# Altium schematic sheet FLS.SchDoc
size A0
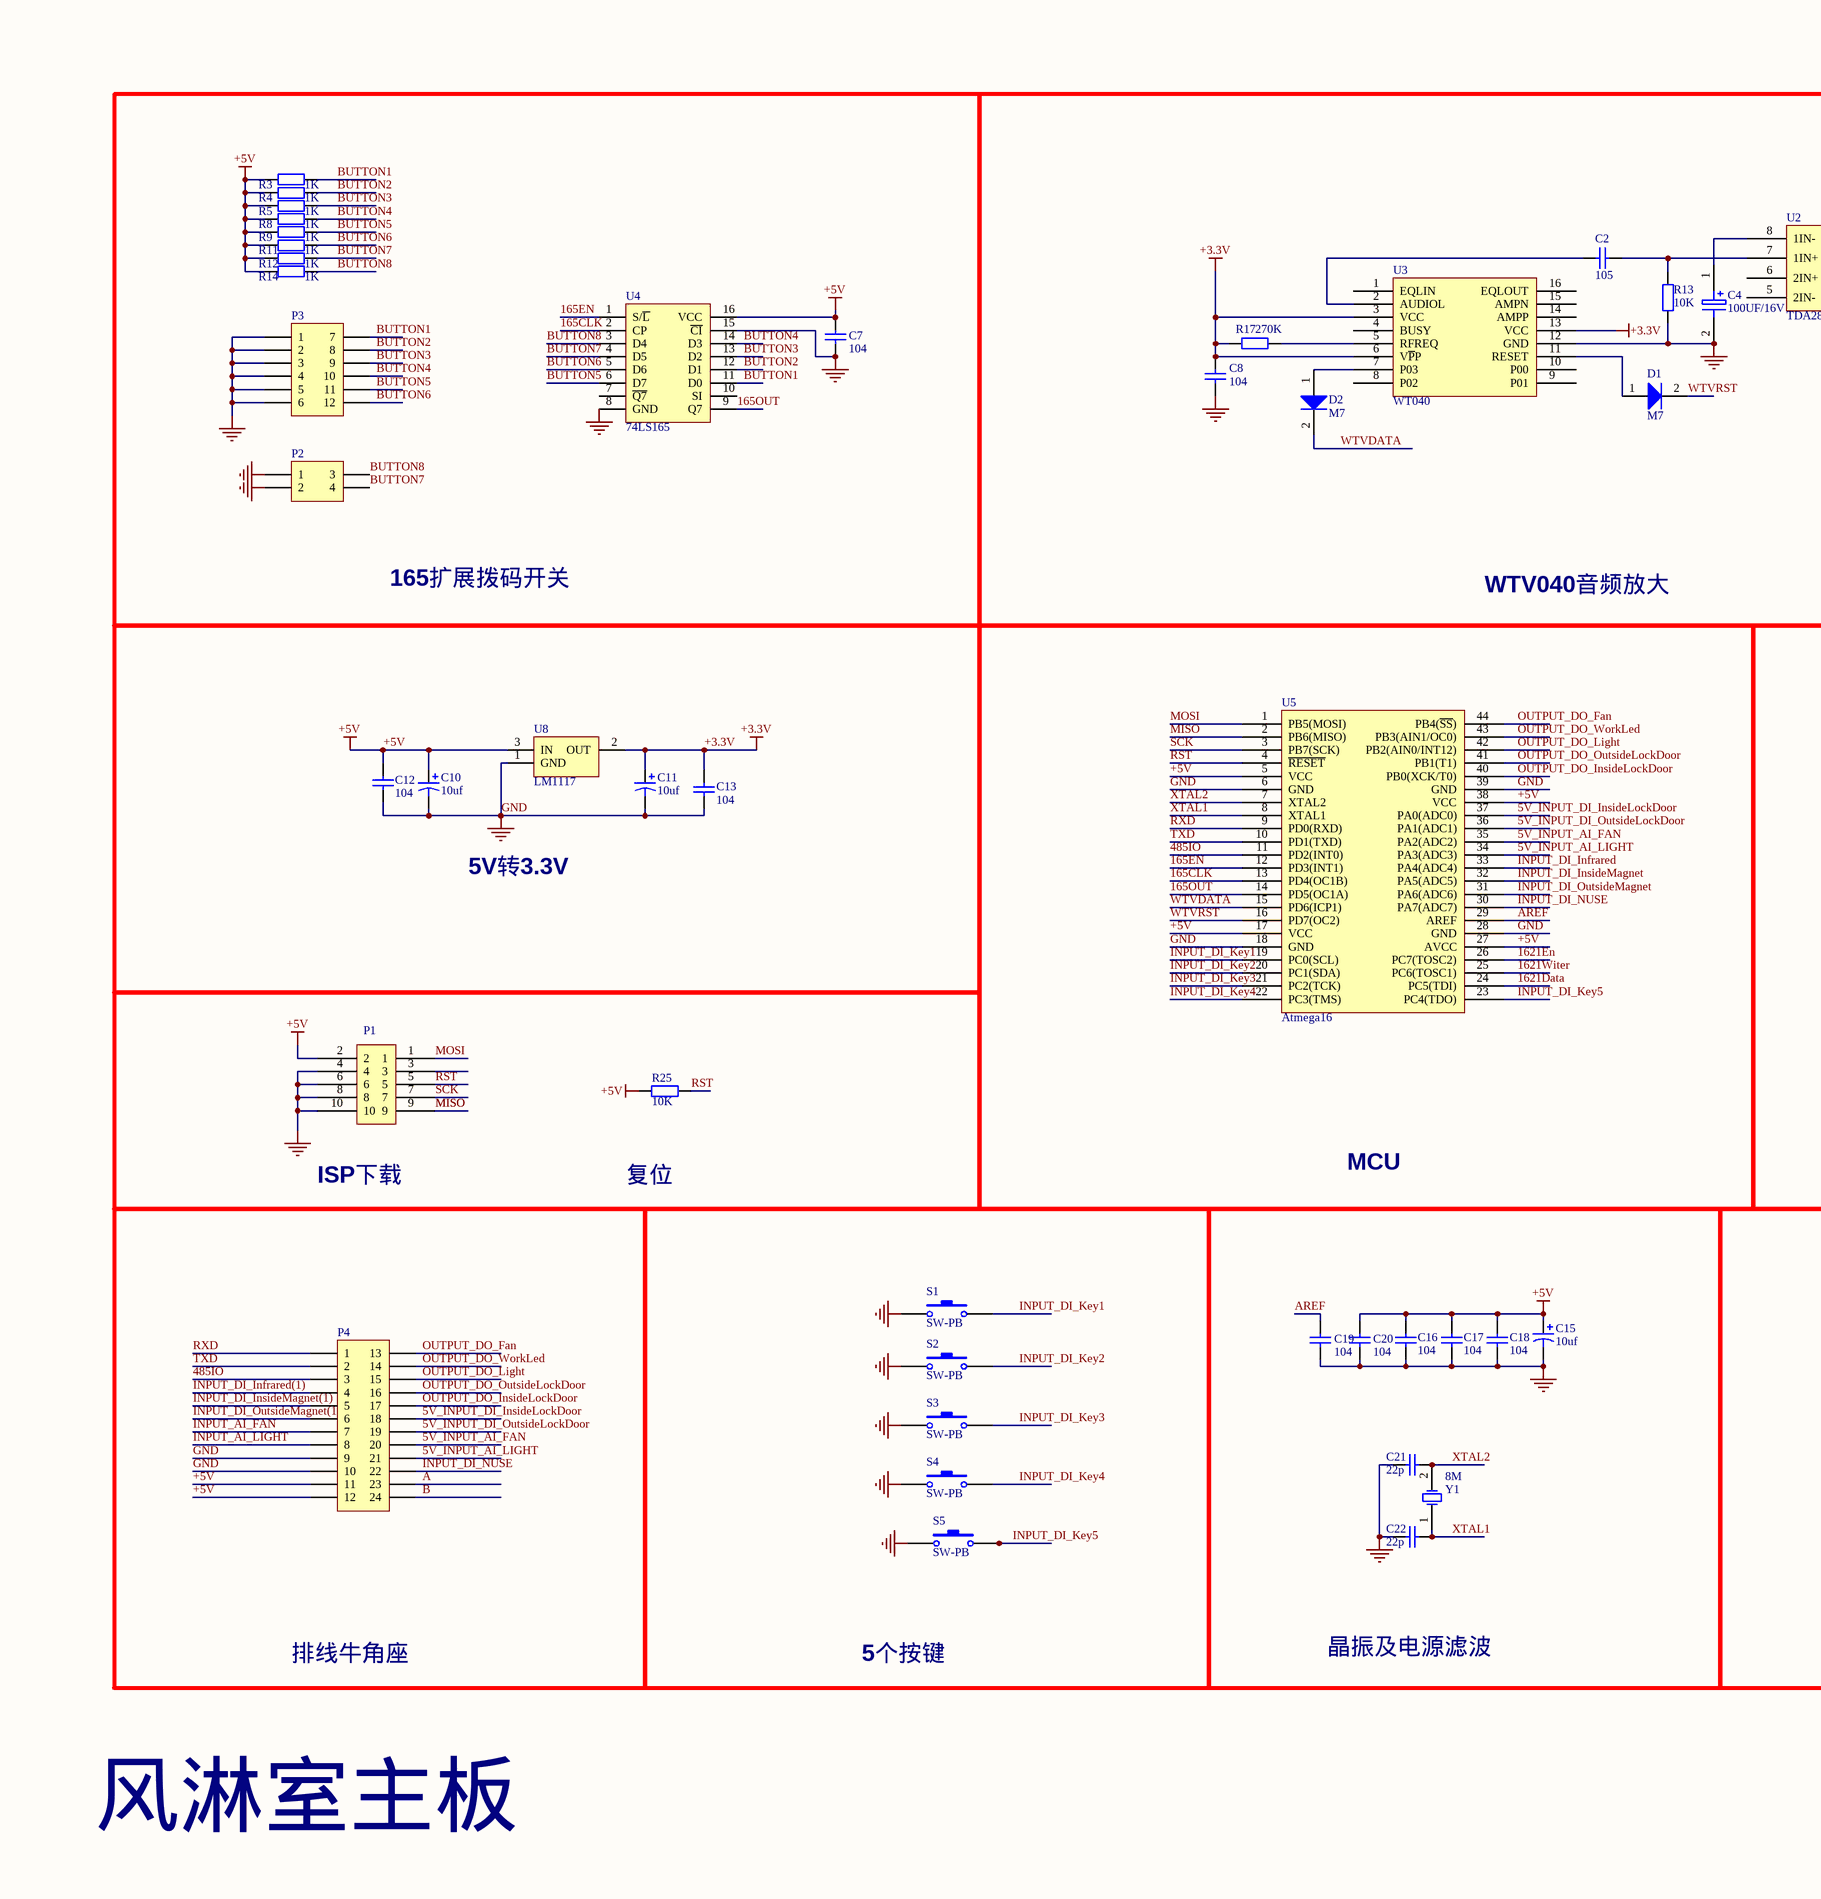
[diagram p0: FLS.SchDoc, top left]
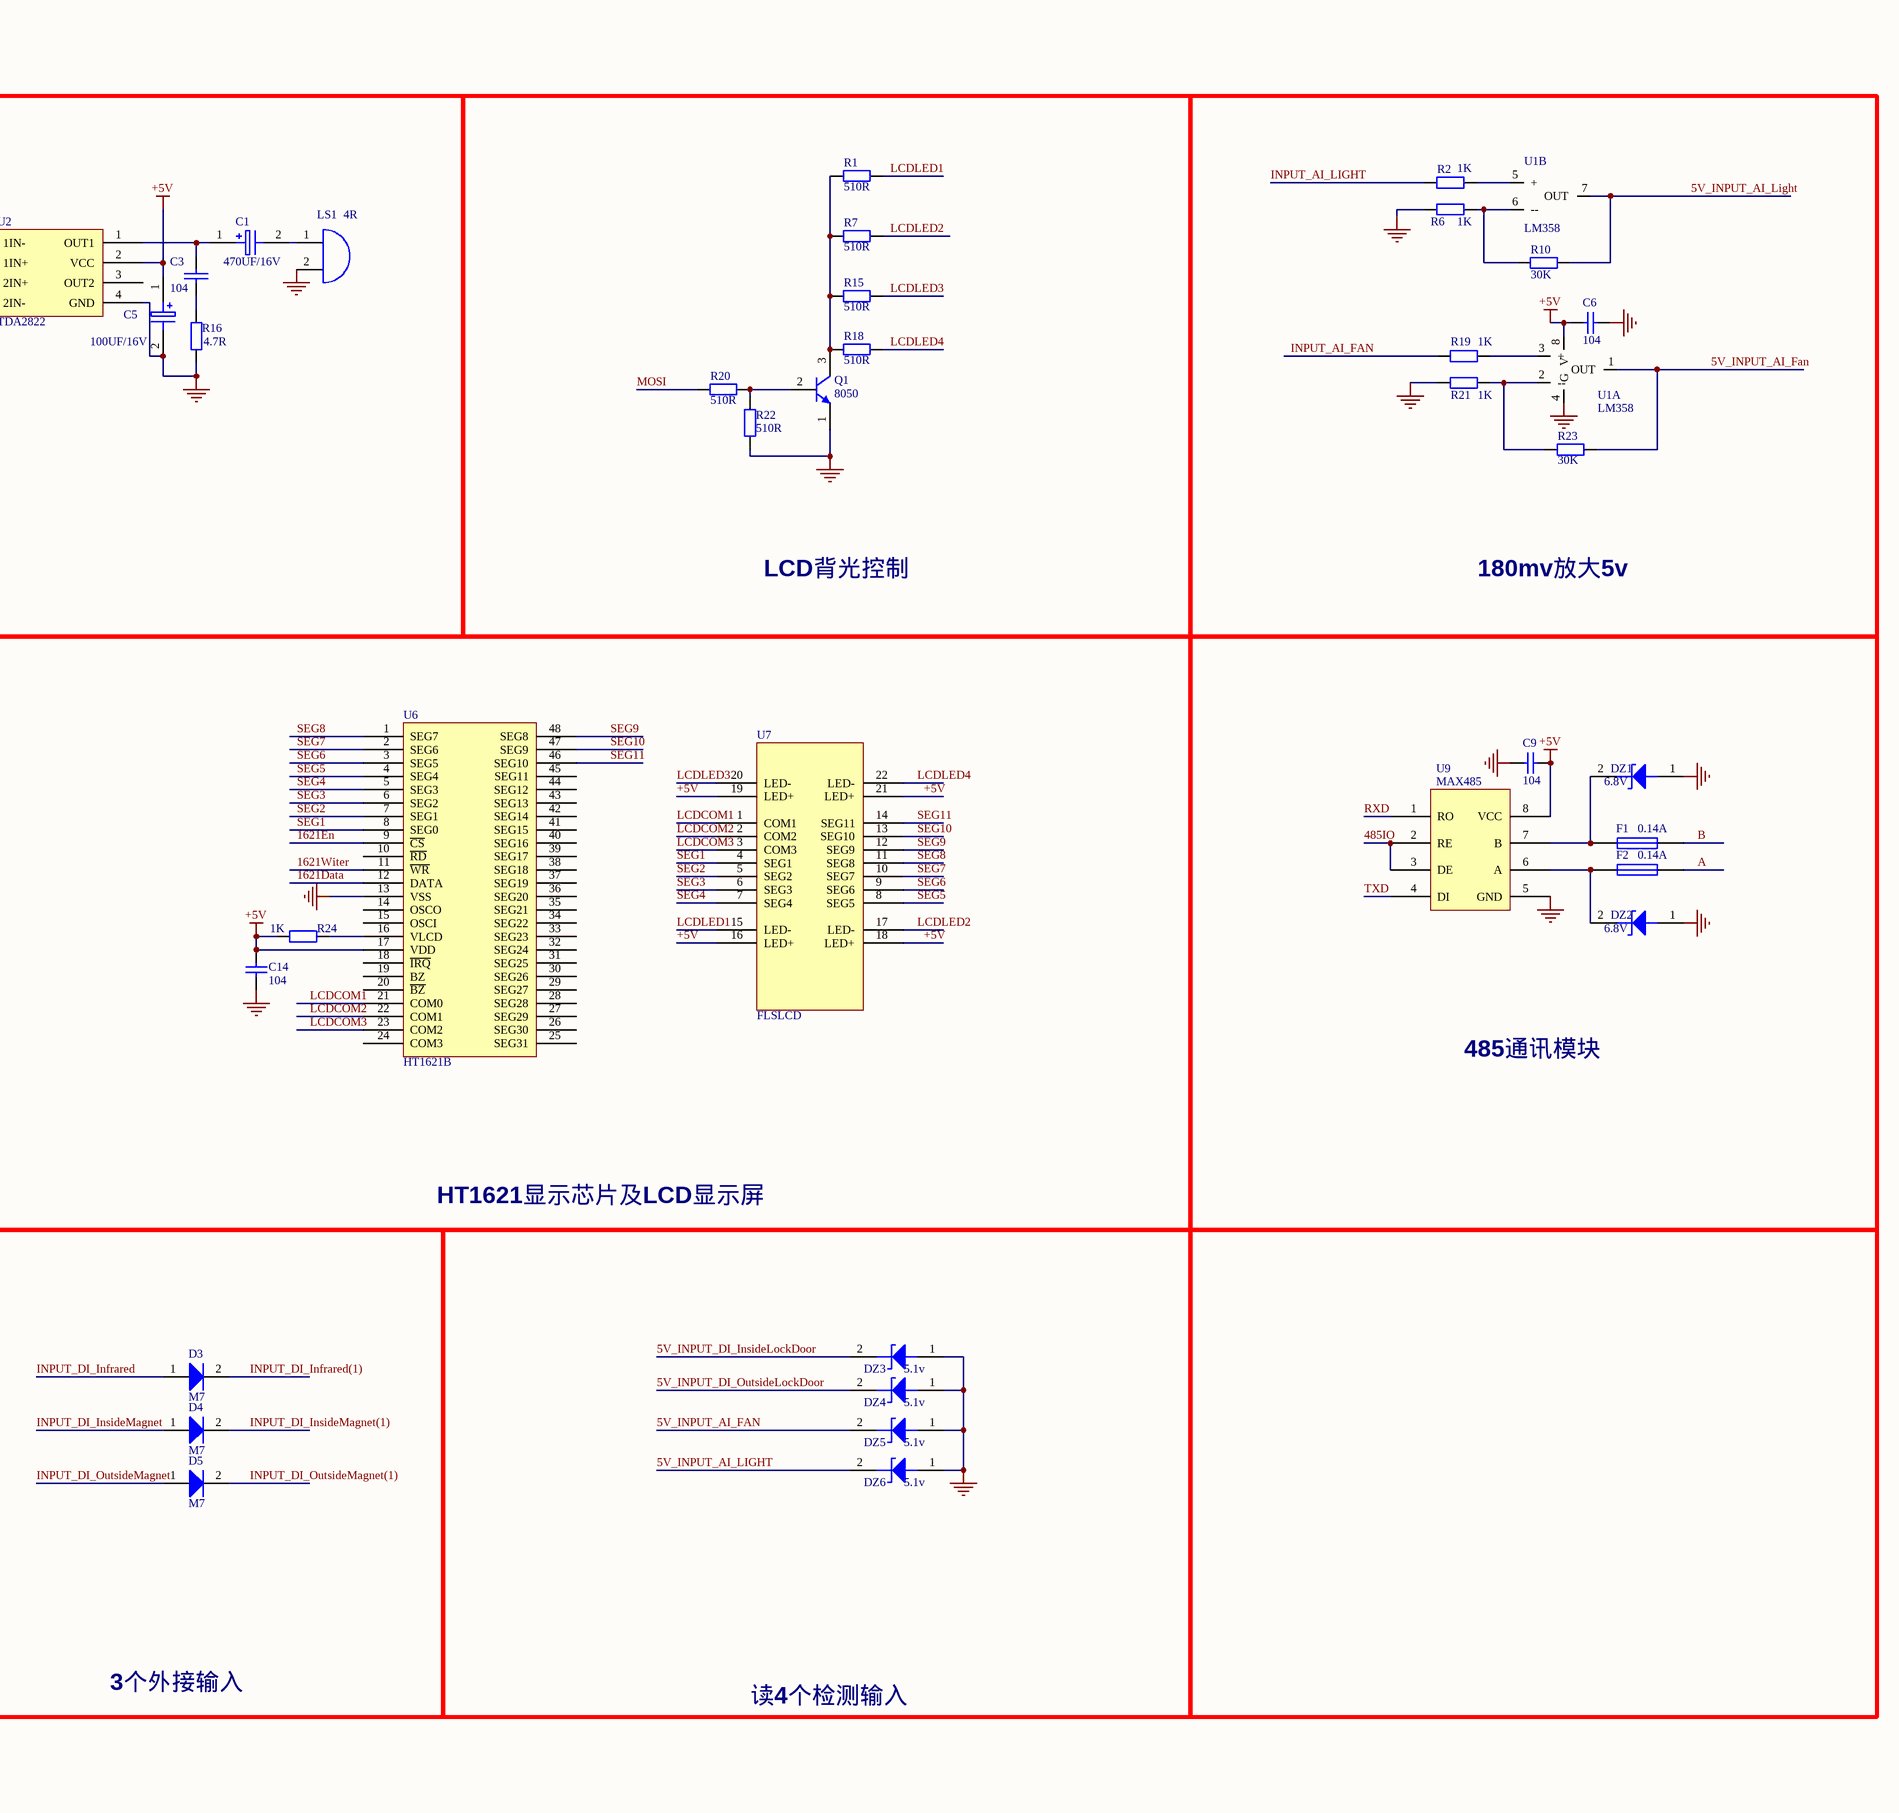
[diagram p1: FLS.SchDoc, top middle]
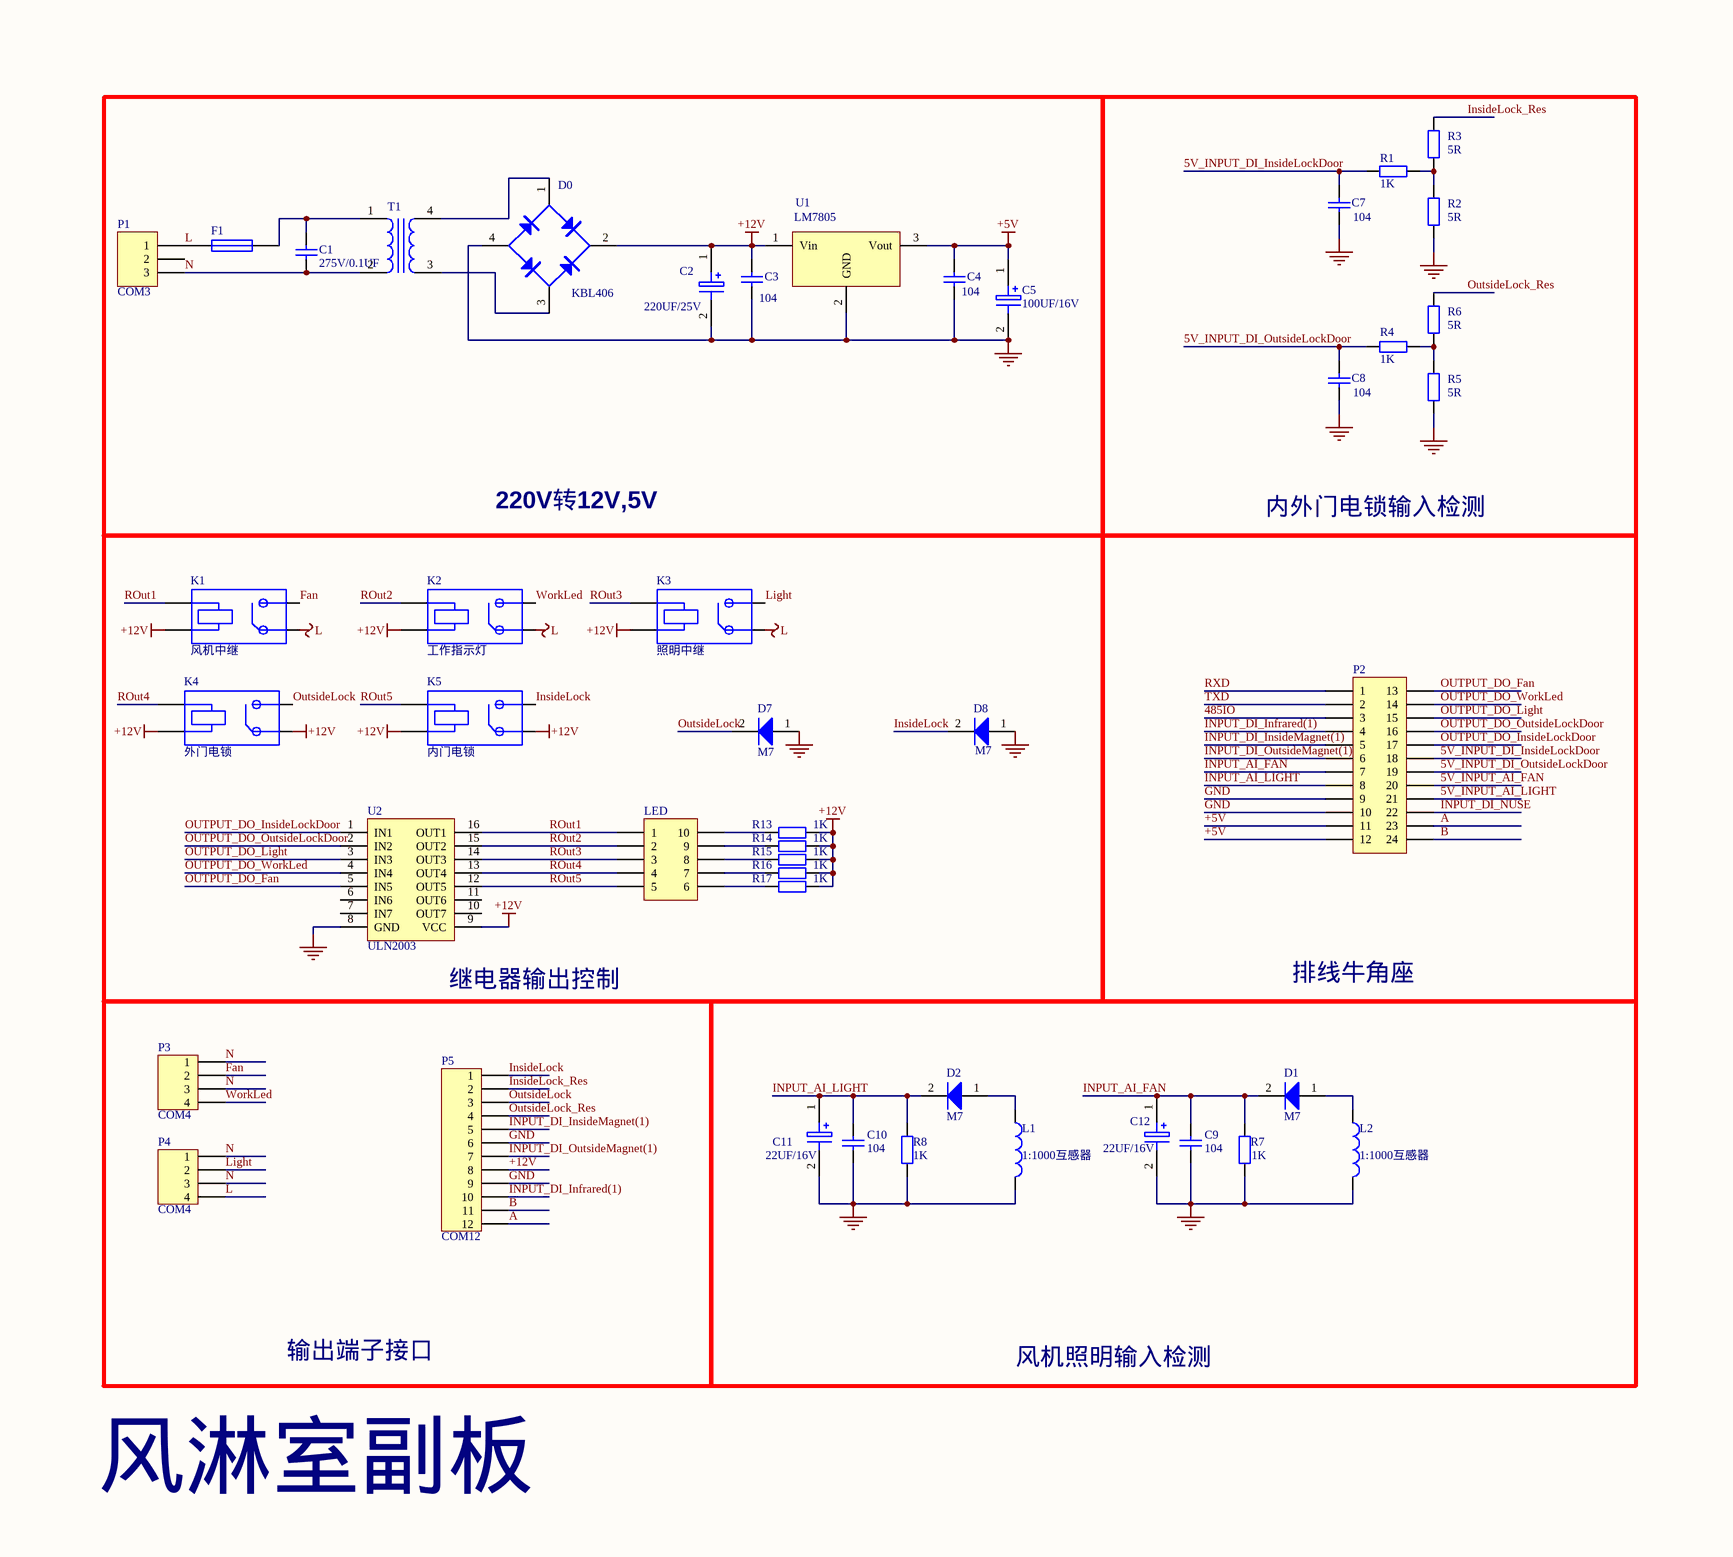
[diagram p2: FLS.SchDoc, bottom left]

## Parts
(Parts that share a designator on the sheet are numbered #1, #2 ... from top to bottom, then left to right.)
C1#1  470UF/16V  [E6.5MM]
C1#2  275V/0.1UF  [cap13.5mm]
C2#1  105  [0805C]
C2#2  220UF/25V  [E10mm]
C3#1  104  [0805C]
C3#2  104  [C100]
C4#1  100UF/16V  [E6.5MM]
C4#2  104  [C100]
C5#1  100UF/16V  [E6.5MM]
C5#2  100UF/16V  [E10mm]
C6  104  [0805C]
C7#1  104  [0805C]
C7#2  104  [C100]
C8#1  104  [0805C]
C8#2  104  [C100]
C9#1  104  [0805C]
C9#2  104  [C100]
C10#1  10uf  [E6.5MM]
C10#2  104  [C100]
C11#1  10uf  [E6.5MM]
C11#2  22UF/16V  [E5mm]
C12#1  104  [0805C]
C12#2  22UF/16V  [E5mm]
C13  104  [0805C]
C14  104  [0805C]
C15  10uf  [E6.5MM]
C16  104  [0805C]
C17  104  [0805C]
C18  104  [0805C]
C19  104  [0805C]
C20  104  [0805C]
C21  22p  [0805C]
C22  22p  [0805C]
D0  KBL406  [BL406]
D1#1  M7  [M7]
D1#2  M7  [DIODE2]
D2#1  M7  [M7]
D2#2  M7  [DIODE2]
D3  M7  [m7]
D4  M7  [M7]
D5  M7  [M7]
D7  M7  [DIODE2]
D8  M7  [DIODE2]
DZ1  6.8V  [SMBJ]
DZ2  6.8V  [SMBJ]
DZ3  5.1v  [3.3稳压管]
DZ4  5.1v  [3.3稳压管]
DZ5  5.1v  [3.3稳压管]
DZ6  5.1v  [3.3稳压管]
F1#1  0.14A  [保险丝140MA]
F1#2  (no value)  [RAD0.878]
F2  0.14A  [保险丝140MA]
K1  风机中继  [RELAY12V]
K2  工作指示灯  [RELAY12V]
K3  照明中继  [RELAY12V]
K4  外门电锁  [RELAY12V]
K5  内门电锁  [RELAY12V]
L1  1:1000互感器  [DL13.5MM]
L2  1:1000互感器  [DL13.5MM]
LED  (no value)  [DIP20]
LS1  4R  [2]
P1#1  CON10  [ISP]  (value not drawn)
P1#2  COM3  [PL3]
P2#1  (no value)  [4P]
P2#2  Header 12X2A  [20P]  (value not drawn)
P3#1  Header 6X2A  [12P]  (value not drawn)
P3#2  COM4  [PL4]
P4#1  Header 12X2A  [20P]  (value not drawn)
P4#2  COM4  [PL4]
P5  COM12  [PL12]
Q1  8050  [SO-G3/C2.5]
R1#1  510R  [0805R]
R1#2  1K  [AXIAL0.4]
R2#1  1K  [0805R]
R2#2  5R  [AXIAL-0.6]
R3#1  1K  [0805R]
R3#2  5R  [AXIAL-0.6]
R4#1  1K  [0805R]
R4#2  1K  [AXIAL0.4]
R5#1  1K  [0805R]
R5#2  5R  [AXIAL-0.6]
R6#1  1K  [0805R]
R6#2  5R  [AXIAL-0.6]
R7#1  510R  [0805R]
R7#2  1K  [AXIAL0.4]
R8#1  1K  [0805R]
R8#2  1K  [AXIAL0.4]
R9  1K  [0805R]
R10  30K  [0805R]
R11  1K  [0805R]
R12  1K  [0805R]
R13#1  10K  [0805R]
R13#2  1K  [AXIAL0.4]
R14#1  1K  [0805R]
R14#2  1K  [AXIAL0.4]
R15#1  510R  [0805R]
R15#2  1K  [AXIAL0.4]
R16#1  4.7R  [0805R]
R16#2  1K  [AXIAL0.4]
R17#1  270K  [0805R]
R17#2  1K  [AXIAL0.4]
R18  510R  [0805R]
R19  1K  [0805R]
R20  510R  [0805R]
R21  1K  [0805R]
R22  510R  [0805R]
R23  30K  [0805R]
R24  1K  [0805R]
R25  10K  [0805R]
S1  SW-PB  [KEYL]
S2  SW-PB  [KEYL]
S3  SW-PB  [KEYL]
S4  SW-PB  [KEYL]
S5  SW-PB  [KEYL]
T1  bianyaqi  [TTT]  (value not drawn)
U1#1  LM358  [SOP8]  (parts A,B of 2)
U1#2  LM7805  [TO220L]
U2#1  TDA2822  [SOP8]
U2#2  ULN2003  [DIP16]
U3  WT040  [SOP-16]
U4  74LS165  [SOP-16]
U5  Atmega16  [44A]
U6  HT1621B  [SOP48 - DUPLICATE]
U7  FLSLCD  [LCD]
U8  LM1117  [SOT-223]
U9  MAX485  [SOP8]
Y1  8M  [XTP2]

## Blocks framed on the sheet
165扩展拨码开关: C7#1 P2#1 P3#1 R3#1 R4#1 R5#1 R8#1 R9 R11 R12 R14#1 U4
WTV040音频放大: C1#1 C2#1 C3#1 C4#1 C5#1 C8#1 D1#1 D2#1 LS1 R13#1 R16#1 R17#1 U2#1 U3
LCD背光控制: Q1 R1#1 R7#1 R15#1 R18 R20 R22
180mv放大5v: C6 R2#1 R6#1 R10 R19 R21 R23 U1#1
5V转3.3V: C10#1 C11#1 C12#1 C13 U8
MCU: U5
HT1621显示芯片及LCD显示屏: C14 R24 U6 U7
485通讯模块: C9#1 DZ1 DZ2 F1#1 F2 U9
排线牛角座: P4#1
5个按键: S1-S5
晶振及电源滤波: C15-C22 Y1
3个外接输入: D3-D5
读4个检测输入: DZ3-DZ6
220V转12V,5V: C1#2 C2#2 C3#2 C4#2 C5#2 D0 F1#2 P1#2 T1 U1#2
内外门电锁输入检测: C7#2 C8#2 R1#2 R2#2 R3#2 R4#2 R5#2 R6#2
继电器输出控制: D7 D8 K1-K5 LED R13#2 R14#2 R15#2 R16#2 R17#2 U2#2
排线牛角座: P2#2
风机照明输入检测: C9#2 C10#2 C11#2 C12#2 D1#2 D2#2 L1 L2 R7#2 R8#2

## Nets
+3.3V: C8#1.2 C11#1.1 C13.2 R17#1.2 U3.3(VCC) U3.6(V~{P}P) U3.13(VCC) U8.2(OUT)
+5V: C4#2.2 C5#1.1 C5#2.1 C6.1 C7#1.2 C9#1.1 C10#1.1 C12#1.2 C14.2 C15.1 C16.2 C17.2 C18.1 C20.2 P1#1.2 P2#2.11 P2#2.12 P4#1.11 P4#1.12 R3#1.1 R4#1.1 R5#1.1 R8#1.1 R9.1 R11.1 R12.1 R14#1.1 R24.2 R25.2 U1#1.8(V) U1#2.3(Vout) U2#1.2(VCC) U4.16(VCC) U5.5(VCC) U5.17(VCC) U5.27(AVCC) U5.38(VCC) U6.17(VDD) U7.16(LED+) U7.18(LED+) U7.19(LED+) U7.21(LED+) U8.3(IN) U9.8(VCC)
+12V: C2#2.1 C3#2.2 D0.2(V+) K1.2 K2.2 K3.2 K4.2 K4.4 K5.2 K5.4 P5.8 R13#2.1 R14#2.1 R15#2.1 R16#2.1 R17#2.1 U1#2.1(Vin) U2#2.9(VCC)
GND: C2#2.2 C3#2.1 C4#1.2 C4#2.1 C5#1.2 C5#2.2 C6.2 C7#1.1 C7#2.1 C8#1.1 C8#2.1 C9#1.2 C9#2.2 C10#1.2 C10#2.2 C11#1.2 C11#2.2 C12#1.1 C12#2.2 C13.1 C14.1 C15.2 C16.1 C17.1 C18.2 C19.1 C20.1 C21.2 C22.2 D0.4(V-) D7.1(A) D8.1(A) DZ1.1(A) DZ2.1(A) DZ3.1(A) DZ4.1(A) DZ5.1(A) DZ6.1(A) L1.1 L2.1 LS1.2(B) P1#1.4 P1#1.6 P1#1.8 P1#1.10 P2#1.1 P2#1.2 P2#2.9 P2#2.10 P3#1.1 P3#1.2 P3#1.3 P3#1.4 P3#1.5 P3#1.6 P4#1.9 P4#1.10 P5.6 P5.9 Q1.1(E) R2#2.2 R5#2.1 R6#1.2 R7#2.2 R8#2.1 R13#1.2 R16#1.1 R21.1 R22.1 S1.1 S2.1 S3.1 S4.1 S5.1 U1#1.4(G) U1#2.2(GND) U2#1.4(GND) U2#2.8(GND) U3.12(GND) U4.8(GND) U4.15(~{CI}) U5.6(GND) U5.18(GND) U5.28(GND) U5.39(GND) U6.13(VSS) U8.1(GND) U9.5(GND)
L: F1#2.2 K1.4 K2.4 K3.4 P1#2.1 P4#2.4
5V_INPUT_AI_FAN: DZ5.2(K) P2#2.20 P4#1.20 R23.2 U1#1.1(OUT) U5.35(PA2(ADC2))
5V_INPUT_AI_LIGHT: DZ6.2(K) P2#2.21 P4#1.21 R10.1 U1#1.7(OUT) U5.34(PA3(ADC3))
5V_INPUT_DI_InsideLockDoor: C7#2.2 DZ3.2(K) P2#2.18 P4#1.18 R1#2.2 U5.37(PA0(ADC0))
5V_INPUT_DI_OutsideLockDoor: C8#2.2 DZ4.2(K) P2#2.19 P4#1.19 R4#2.1 U5.36(PA1(ADC1))
165CLK: U4.2(CP) U5.13(PD4(OC1B))
165EN: U4.1(S/~{L}) U5.12(PD3(INT1))
165OUT: U4.9(Q7) U5.14(PD5(OC1A))
485IO: P2#2.3 P4#1.3 U5.11(PD2(INT0)) U9.2(RE) U9.3(DE)
1621Data: U5.24(PC5(TDI)) U6.12(DATA)
1621En: U5.26(PC7(TOSC2)) U6.9(~{CS})
1621Witer: U5.25(PC6(TOSC1)) U6.11(~{WR})
A: F2.1 P2#2.23 P4#1.23 P5.12
AREF: C19.2 U5.29(AREF)
B: F1#1.2 P2#2.24 P4#1.24 P5.11
BUTTON1: P3#1.7 R3#1.2 U4.11(D0)
BUTTON2: P3#1.8 R4#1.2 U4.12(D1)
BUTTON3: P3#1.9 R5#1.2 U4.13(D2)
BUTTON4: P3#1.10 R8#1.2 U4.14(D3)
BUTTON5: P3#1.11 R9.2 U4.6(D7)
BUTTON6: P3#1.12 R11.2 U4.5(D6)
BUTTON7: P2#1.4 R12.2 U4.4(D5)
BUTTON8: P2#1.3 R14#1.2 U4.3(D4)
Fan: K1.3 P3#2.2
INPUT_AI_FAN: C9#2.1 C12#2.1 D1#2.2(K) P2#2.7 P4#1.7 R7#2.1 R19.2
INPUT_AI_LIGHT: C10#2.1 C11#2.1 D2#2.2(K) P2#2.8 P4#1.8 R2#1.2 R8#2.2
INPUT_DI_Infrared: D3.1(A) U5.33(PA4(ADC4))
INPUT_DI_Infrared(1): D3.2(K) P2#2.4 P4#1.4 P5.10
INPUT_DI_InsideMagnet: D4.1(A) U5.32(PA5(ADC5))
INPUT_DI_InsideMagnet(1): D4.2(K) P2#2.5 P4#1.5 P5.5
INPUT_DI_Key1: S1.2 U5.19(PC0(SCL))
INPUT_DI_Key2: S2.2 U5.20(PC1(SDA))
INPUT_DI_Key3: S3.2 U5.21(PC2(TCK))
INPUT_DI_Key4: S4.2 U5.22(PC3(TMS))
INPUT_DI_Key5: S5.2 U5.23(PC4(TDO))
INPUT_DI_NUSE: P2#2.22 P4#1.22 U5.30(PA7(ADC7))
INPUT_DI_OutsideMagnet: D5.1(A) U5.31(PA6(ADC6))
INPUT_DI_OutsideMagnet(1): D5.2(K) P2#2.6 P4#1.6 P5.7
InsideLock: D8.2(K) K5.3 P5.1
InsideLock_Res: P5.2 R3#2.1
LCDCOM1: U6.21(COM0) U7.1(COM1)
LCDCOM2: U6.22(COM1) U7.2(COM2)
LCDCOM3: U6.23(COM2) U7.3(COM3)
LCDLED1: R1#1.1 U7.15(LED-)
LCDLED2: R7#1.1 U7.17(LED-)
LCDLED3: R15#1.1 U7.20(LED-)
LCDLED4: R18.1 U7.22(LED-)
Light: K3.3 P4#2.2
MISO: P1#1.9 U5.2(PB6(MISO))
MOSI: P1#1.1 R20.1 U5.1(PB5(MOSI))
N: C1#2.1 P1#2.3 P3#2.1 P3#2.3 P4#2.1 P4#2.3 T1.2
OUTPUT_DO_Fan: P2#2.13 P4#1.13 U2#2.5(IN5) U5.44(PB4(~{SS}))
OUTPUT_DO_InsideLockDoor: P2#2.17 P4#1.17 U2#2.1(IN1) U5.40(PB0(XCK/T0))
OUTPUT_DO_Light: P2#2.15 P4#1.15 U2#2.3(IN3) U5.42(PB2(AIN0/INT12))
OUTPUT_DO_OutsideLockDoor: P2#2.16 P4#1.16 U2#2.2(IN2) U5.41(PB1(T1))
OUTPUT_DO_WorkLed: P2#2.14 P4#1.14 U2#2.4(IN4) U5.43(PB3(AIN1/OC0))
OutsideLock: D7.2(K) K4.3 P5.3
OutsideLock_Res: P5.4 R6#2.2
ROut1: K1.1 LED.1 U2#2.16(OUT1)
ROut2: K2.1 LED.2 U2#2.15(OUT2)
ROut3: K3.1 LED.3 U2#2.14(OUT3)
ROut4: K4.1 LED.4 U2#2.13(OUT4)
ROut5: K5.1 LED.5 U2#2.12(OUT5)
RST: P1#1.5 R25.1 U5.4(~{RESET})
RXD: P2#2.1 P4#1.1 U5.9(PD0(RXD)) U9.1(RO)
SCK: P1#1.7 U5.3(PB7(SCK))
SEG1: U6.8(SEG0) U7.4(SEG1)
SEG2: U6.7(SEG1) U7.5(SEG2)
SEG3: U6.6(SEG2) U7.6(SEG3)
SEG4: U6.5(SEG3) U7.7(SEG4)
SEG5: U6.4(SEG4) U7.8(SEG5)
SEG6: U6.3(SEG5) U7.9(SEG6)
SEG7: U6.2(SEG6) U7.10(SEG7)
SEG8: U6.1(SEG7) U7.11(SEG8)
SEG9: U6.48(SEG8) U7.12(SEG9)
SEG10: U6.47(SEG9) U7.13(SEG10)
SEG11: U6.46(SEG10) U7.14(SEG11)
TXD: P2#2.2 P4#1.2 U5.10(PD1(TXD)) U9.4(DI)
WorkLed: K2.3 P3#2.4
WTVDATA: D2#1.2(K) U5.15(PD6(ICP1))
WTVRST: D1#1.2(K) U5.16(PD7(OC2))
XTAL1: C22.1 U5.8(XTAL1) Y1.1(OSC1)
XTAL2: C21.1 U5.7(XTAL2) Y1.2(OSC2)
NetC1#1_1: C1#1.1 C3#1.2 U2#1.1(OUT1)
NetC1#1_2: C1#1.2 LS1.1(A)
NetC1#2_2: C1#2.2 F1#2.1 T1.1
NetC2#1_1: C2#1.1 R13#1.1 U2#1.7(1IN+)
NetC2#1_2: C2#1.2 U3.2(AUDIOL)
NetC3#1_1: C3#1.1 R16#1.2
NetC4#1_1: C4#1.1 U2#1.8(1IN-)
NetD0_1: D0.1(AC) T1.4
NetD0_3: D0.3(AC) T1.3
NetD1#1_1: D1#1.1(A) U3.11(RESET)
NetD1#2_1: D1#2.1(A) L2.2
NetD2#1_1: D2#1.1(A) U3.7(P03)
NetD2#2_1: D2#2.1(A) L1.2
NetDZ1_2: DZ1.2(K) F1#1.1 U9.7(B)
NetDZ2_2: DZ2.2(K) F2.2 U9.6(A)
NetLED_6: LED.6 R17#2.2
NetLED_7: LED.7 R16#2.2
NetLED_8: LED.8 R15#2.2
NetLED_9: LED.9 R14#2.2
NetLED_10: LED.10 R13#2.2
NetQ1_2: Q1.2(B) R20.2 R22.2
NetQ1_3: Q1.3(C) R1#1.2 R7#1.2 R15#1.2 R18.2
NetR1#2_1: R1#2.1 R2#2.1 R3#2.2
NetR2#1_1: R2#1.1 U1#1.5(+)
NetR4#2_2: R4#2.2 R5#2.2 R6#2.1
NetR6#1_1: R6#1.1 R10.2 U1#1.6(--)
NetR17#1_1: R17#1.1 U3.5(RFREQ)
NetR19_1: R19.1 U1#1.3(+)
NetR21_2: R21.2 R23.1 U1#1.2(--)
NetR24_1: R24.1 U6.16(VLCD)

Not connected (* = marked no-connect by the designer): P1#1 3; P1#2 2; U2#1 3(OUT2) 5(2IN-) 6(2IN+); U2#2 6(IN6) 7(IN7) 10(OUT7) 11(OUT6); U3 1(EQLIN) 4(BUSY) 8(P02) 9(P01) 10(P00) 14(AMPP) 15(AMPN) 16(EQLOUT); U4 7(~{Q7}) 10(SI); U6 10(~{RD}) 14(OSCO) 15(OSCI) 18(~{IRQ}) 19(BZ) 20(~{BZ}) 24(COM3) 25(SEG31) 26(SEG30) 27(SEG29) 28(SEG28) 29(SEG27) 30(SEG26) 31(SEG25) 32(SEG24) 33(SEG23) 34(SEG22) 35(SEG21) 36(SEG20) 37(SEG19) 38(SEG18) 39(SEG17) 40(SEG16) 41(SEG15) 42(SEG14) 43(SEG13) 44(SEG12) 45(SEG11)

## Notes on the sheet
- ISP下载
- 复位
- 风淋室主板
- 输出端子接口
- 风淋室副板

## Library data of the parts
C1#1 C2#2 C4#1 C5#1 C5#2 C11#2 C12#2 = ELECTRO1: Electrolytic Capacitor; Comment_1: 1000UF/25V; Comment_2: 1000UF/25V
C1#2 C2#1 C3#2 C4#2 C6 C7#1 C7#2 C8#1 C8#2 C9#1 C9#2 C10#2 C12#1 C13 C14 C16-C22 = Cap: Capacitor; Published: 8-Jun-2000; LatestRevisionDate: 17-Jul-2002; LatestRevisionNote: Re-released for DXP Platform.; Publisher: Altium Limited
  C1#2: Value: 275V/0.1UF
  C2#1: Value: 105
  C3#2 C4#2 C6 C7#1 C7#2 C8#1 C8#2 C9#1 C9#2 C10#2 C12#1 C13 C14 C16-C20: Value: 104
  C21 C22: Value: 22P
C3#1 = CAP: Capacitor
C10#1 C11#1 C15 = Cap Pol1: Polarized Capacitor (Radial); Published: 8-Jun-2000; LatestRevisionDate: 17-Jul-2002; LatestRevisionNote: Re-released for DXP Platform.; Publisher: Altium Limited; Value: 10uf
D0 = BRIDGE1: Diode Bridge
D1#1 D2#1 = Diode 1N4005: 1 Amp General Purpose Rectifier; Published: 8-Jun-2000; LatestRevisionDate: 17-Jul-2002; LatestRevisionNote: Re-released for DXP Platform.; DatasheetDocument: 1998; PackageDocument: Aug-1999; PackageReference: DO-41; Publisher: Altium Limited; Code_JEDEC: DO-204-AL
D1#2 D2#2 = Diode: Default Diode; Published: 8-Jun-2000; LatestRevisionDate: 17-Jul-2002; LatestRevisionNote: Re-released for DXP Platform.; Publisher: Altium Limited; Code_JEDEC: DO-214-AB
D3-D5 D7 D8 = Diode 1N4001: 1 Amp General Purpose Rectifier; Published: 8-Jun-2000; LatestRevisionDate: 17-Jul-2002; LatestRevisionNote: Re-released for DXP Platform.; DatasheetDocument: 1998; PackageDocument: Aug-1999; PackageReference: DO-41; Publisher: Altium Limited; Code_JEDEC: DO-204-AL
DZ1-DZ6 = ZENER2: Zener Diode
F1#1 F2 = FUSE1: Fuse
F1#2 = Fuse 1: Fuse; Published: 8-Jun-2000; LatestRevisionDate: 17-Jul-2002; LatestRevisionNote: Re-released for DXP Platform.; Publisher: Altium Limited
K1-K5 = RELAY
L1 L2 = Inductor: Code_IEC: 1005; Value: 10mH; Published: 8-Jun-2000; LatestRevisionDate: 17-Jul-2002; LatestRevisionNote: Re-released for DXP Platform.; PackageReference: 0402-A; Publisher: Altium Limited; Code_JEITA: 0402
LED = Header 10X2A: Header, 10-Pin, Dual row; pin to pad: 11>20 12>19 13>18 14>17 15>16 16>15 17>14 18>13 19>12 20>11; LatestRevisionDate: 17-Jul-2002; LatestRevisionNote: Re-released for DXP Platform.; Publisher: Altium Limited
LS1 = Bell: Electrical Bell; Published: 24-Mar-1999; LatestRevisionDate: 17-Jul-2002; LatestRevisionNote: Re-released for DXP Platform.; Publisher: Altium Limited
P1#1 = SPI10
P1#2 = Header 3: Header, 3-Pin; LatestRevisionDate: 17-Jul-2002; LatestRevisionNote: Re-released for DXP Platform.; Publisher: Altium Limited
P2#1 = Header 2X2: Header, 2-Pin, Dual row; LatestRevisionDate: 17-Jul-2002; LatestRevisionNote: Re-released for DXP Platform.; Publisher: Altium Limited
P2#2 P4#1 = Header 12X2A: Header, 12-Pin, Dual row; LatestRevisionDate: 17-Jul-2002; LatestRevisionNote: Re-released for DXP Platform.; Publisher: Altium Limited
P3#1 = Header 6X2A: Header, 6-Pin, Dual row; LatestRevisionDate: 17-Jul-2002; LatestRevisionNote: Re-released for DXP Platform.; Publisher: Altium Limited
Q1 = 2N3904: NPN General Purpose Amplifier; pin to pad: 1>2 2>1; Published: 8-Jun-2000; LatestRevisionDate: 15-Jan-2003; LatestRevisionNote: PCB Footprint 'BCY-W3/D4.7' replaced; DatasheetDocument: 1997; PackageReference: TO-92A; Publisher: Altium Limited; Code_JEDEC: TO-92A
R1#1 R1#2 R2#1 R3#1 R4#1 R4#2 R5#1 R6#1 R7#1 R7#2 R8#1 R8#2 R9-R12 R13#2 R14#1 R14#2 R15#2 R16#2 R17#1 R17#2 R19 R21 R23 R24 = Res2: Resistor; Published: 8-Jun-2000; LatestRevisionDate: 17-Jul-2002; LatestRevisionNote: Re-released for DXP Platform.; Publisher: Altium Limited
  R1#1 R7#1: Value: 510R
  R1#2 R4#2 R7#2 R13#2 R14#2 R15#2 R16#2 R17#2 R24: Value: 1K
  R17#1: Value: 270K
R2#2 R3#2 R5#2 R6#2 = Res2: Resistor; Value: 4R; Published: 8-Jun-2000; LatestRevisionDate: 17-Jul-2002; LatestRevisionNote: Re-released for DXP Platform.; Publisher: Altium Limited
R13#1 R15#1 R16#1 R18 R20 R22 R25 = Res2: Resistor; Value: 1K; Published: 8-Jun-2000; LatestRevisionDate: 17-Jul-2002; LatestRevisionNote: Re-released for DXP Platform.; Publisher: Altium Limited
S1-S5 = SW-PB: Switch; Published: 24-Mar-1999; LatestRevisionDate: 17-Jul-2002; LatestRevisionNote: Re-released for DXP Platform.; PackageReference: SPST-2; Publisher: Altium Limited; PackageDescription: Switch; 2 Leads
U1#2 = VOLTREG
U2#1 = TDA2822: 双声道音频功率发大
U7 = LCD
Y1 = XTAL: Crystal Oscillator; Published: 8-Jun-2000; LatestRevisionDate: 17-Jul-2002; LatestRevisionNote: Re-released for DXP Platform.; Publisher: Altium Limited